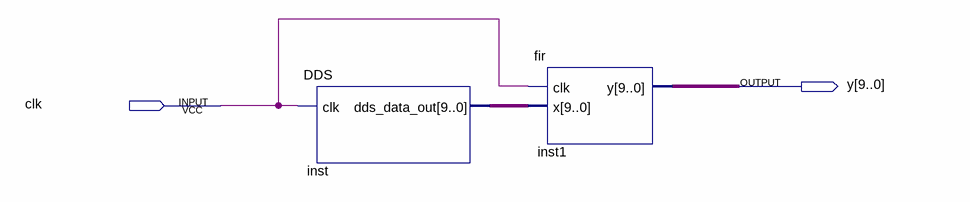
[diagram p0: schematic sheet]
// Quartus schematic DDS_TOP.bdf as structural Verilog: 2 symbols, 2 pins
module DDS_TOP (
  input  clk,
  output [9:0] y
);

  wire [9:0] inst_dds_data_out;

  DDS inst (.clk(clk), .dds_data_out(inst_dds_data_out));
  fir inst1 (.clk(clk), .x(inst_dds_data_out), .y(y));
endmodule
